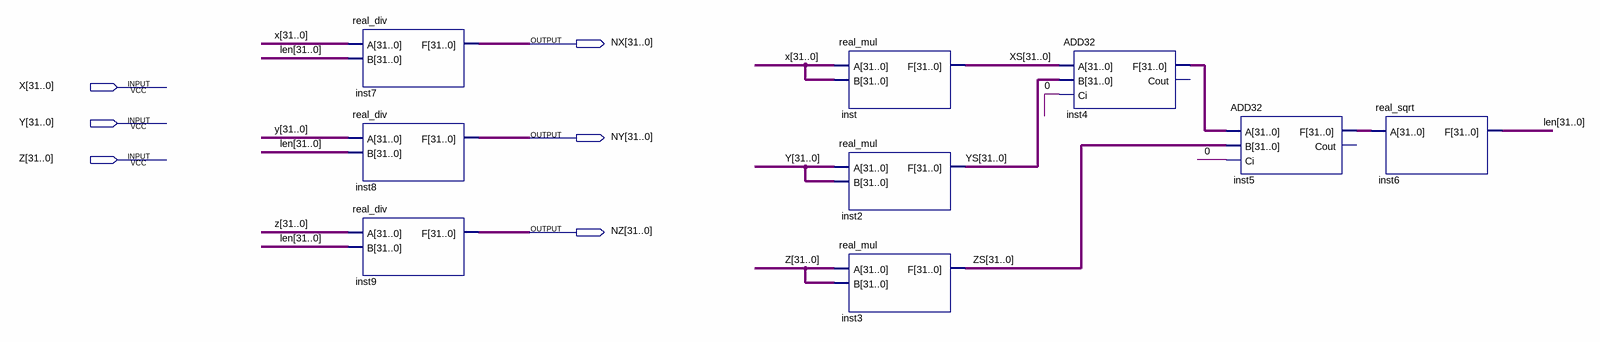
[diagram p0: schematic sheet]
// Quartus schematic vec3_normalized.bdf as structural Verilog: 9 symbols, 6 pins
module vec3_normalized (
  input  [31:0] X,
  input  [31:0] Y,
  input  [31:0] Z,
  output [31:0] NX,
  output [31:0] NY,
  output [31:0] NZ
);

  wire \0 ;
  wire [31:0] inst4_f, inst5_f, len, XS, YS, ZS;

  real_div inst7 (.A(X), .B(len), .F(NX));
  real_div inst8 (.A(Y), .B(len), .F(NY));
  real_div inst9 (.A(Z), .B(len), .F(NZ));
  real_mul inst (.A(X), .B(X), .F(XS));
  real_mul inst2 (.A(Y), .B(Y), .F(YS));
  real_mul inst3 (.A(Z), .B(Z), .F(ZS));
  ADD32 inst4 (.A(XS), .B(YS), .Ci(\0 ), .F(inst4_f));  // open: Cout
  ADD32 inst5 (.A(inst4_f), .B(ZS), .Ci(\0 ), .F(inst5_f));  // open: Cout
  real_sqrt inst6 (.A(inst5_f), .F(len));
endmodule
